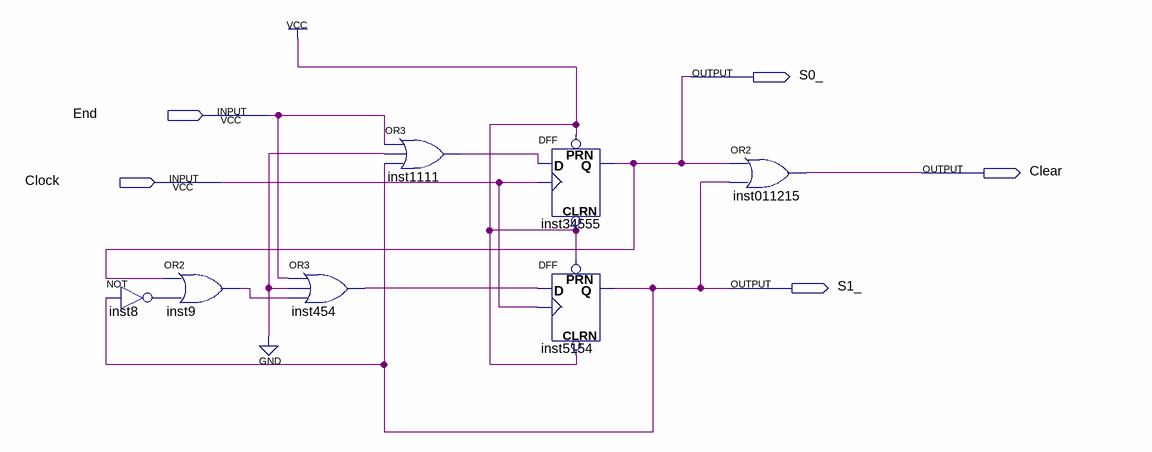
[diagram p0: schematic sheet]
// Quartus schematic FSM.bdf as structural Verilog: 7 symbols, 5 pins
module FSM (
  input  End,
  input  Clock,
  output S0_,
  output Clear,
  output S1_
);

  wire inst8_out, inst9_out, inst454_out, inst1111_out;

  not inst8 (inst8_out, S1_);
  or inst9 (inst9_out, S0_, inst8_out);
  or inst454 (inst454_out, End, 1'b0, inst9_out);
  or inst1111 (inst1111_out, End, 1'b0, S1_);
  DFF inst34555 (.CLRN(1'b1), .CLK(Clock), .D(inst1111_out), .PRN(1'b1), .Q(S0_));
  DFF inst5154 (.CLRN(1'b1), .CLK(Clock), .D(inst454_out), .PRN(1'b1), .Q(S1_));
  or inst011215 (Clear, S0_, S1_);
endmodule
